# Altium project PCB_Project.PrjPcb
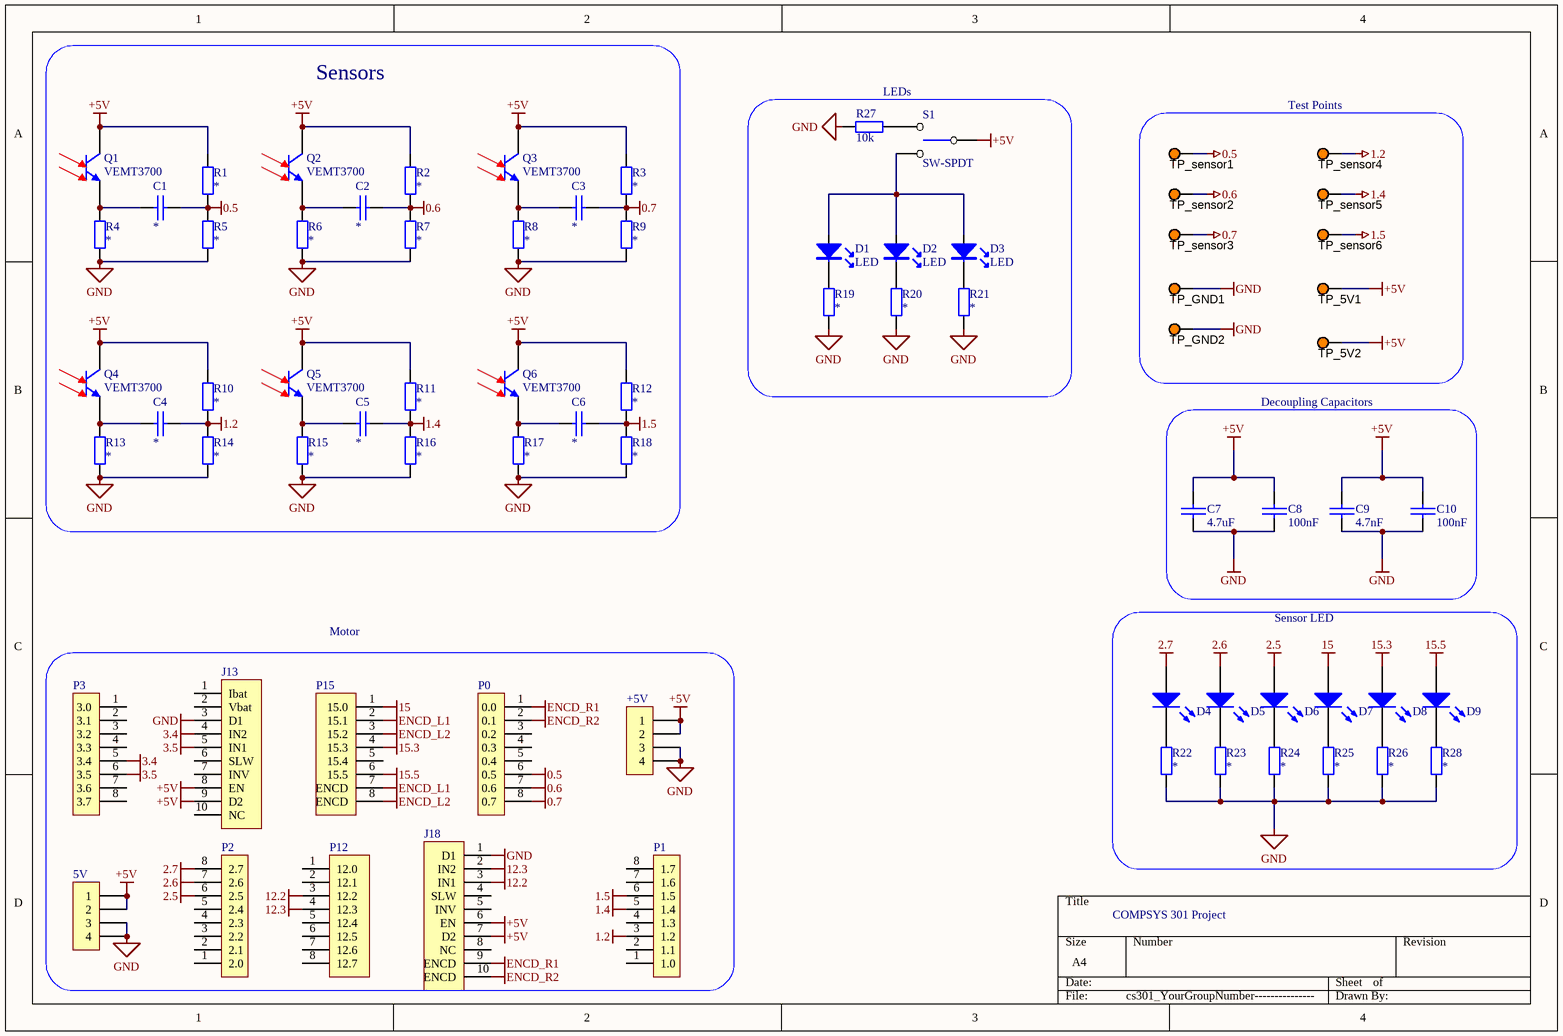
[diagram p0: cs301_YourGroupNumber---------------.SchDoc]
1 sheet, 74 parts. Net scope: global (net labels, ports and power ports of the same name join across sheets).
Board file: cs301_YourGroupNumber--4 holes.PcbDoc

## Sheet cs301_YourGroupNumber---------------.SchDoc
size A4; SheetNumber: 1; SheetTotal: 1

### Parts
5V  5V  [IDC4]  (value not drawn)
+5V  5V  [IDC4]  (value not drawn)
C1  *  [0805 CAP]
C2  *  [0805 CAP]
C3  *  [0805 CAP]
C4  *  [0805 CAP]
C5  *  [0805 CAP]
C6  *  [0805 CAP]
C7  4.7uF  [0805 CAP]
C8  100nF  [0805 CAP]
C9  4.7nF  [0805 CAP]
C10  100nF  [0805 CAP]
D1  LED  [LED0.1/5MM]
D2  LED  [LED0.1/5MM]
D3  LED  [LED0.1/5MM]
D4  LTST-C170KGKT  [0805 LED]  (value not drawn)
D5  LTST-C170KGKT  [0805 LED]  (value not drawn)
D6  LTST-C170KGKT  [0805 LED]  (value not drawn)
D7  LTST-C170KGKT  [0805 LED]  (value not drawn)
D8  LTST-C170KGKT  [0805 LED]  (value not drawn)
D9  LTST-C170KGKT  [0805 LED]  (value not drawn)
J13  CON10  [idc10]  (value not drawn)
J18  CON10  [IDC10]  (value not drawn)
P0  P0  [idc8]  (value not drawn)
P1  P1  [idc8]  (value not drawn)
P2  P2  [idc8]  (value not drawn)
P3  P3  [idc8]  (value not drawn)
P12  P12  [idc8]  (value not drawn)
P15  P15  [idc8]  (value not drawn)
Q1  VEMT3700  [VEMT3700]
Q2  VEMT3700  [VEMT3700]
Q3  VEMT3700  [VEMT3700]
Q4  VEMT3700  [VEMT3700]
Q5  VEMT3700  [VEMT3700]
Q6  VEMT3700  [VEMT3700]
R1  *  [0805 RES]
R2  *  [0805 RES]
R3  *  [0805 RES]
R4  *  [0805 RES]
R5  *  [0805 RES]
R6  *  [0805 RES]
R7  *  [0805 RES]
R8  *  [0805 RES]
R9  *  [0805 RES]
R10  *  [0805 RES]
R11  *  [0805 RES]
R12  *  [0805 RES]
R13  *  [0805 RES]
R14  *  [0805 RES]
R15  *  [0805 RES]
R16  *  [0805 RES]
R17  *  [0805 RES]
R18  *  [0805 RES]
R19  *  [0805 RES]
R20  *  [0805 RES]
R21  *  [0805 RES]
R22  *  [0805 RES]
R23  *  [0805 RES]
R24  *  [0805 RES]
R25  *  [0805 RES]
R26  *  [0805 RES]
R27  10k  [0805 RES]
R28  *  [0805 RES]
S1  SW-SPDT  [SW-SPDT]
TP_5V1  5003  [TP_TH]  (value not drawn)
TP_5V2  5003  [TP_TH]  (value not drawn)
TP_GND1  5003  [TP_TH]  (value not drawn)
TP_GND2  5003  [TP_TH]  (value not drawn)
TP_sensor1  5003  [TP_TH]  (value not drawn)
TP_sensor2  5003  [TP_TH]  (value not drawn)
TP_sensor3  5003  [TP_TH]  (value not drawn)
TP_sensor4  5003  [TP_TH]  (value not drawn)
TP_sensor5  5003  [TP_TH]  (value not drawn)
TP_sensor6  5003  [TP_TH]  (value not drawn)

### Blocks framed on the sheet
Sensors: C1-C6 Q1-Q6 R1-R18
LEDs: D1-D3 R19-R21 R27 S1
Test Points: TP_5V1 TP_5V2 TP_GND1 TP_GND2 TP_sensor1-TP_sensor6
Decoupling Capacitors: C7-C10
Sensor LED: D4-D9 R22-R26 R28
Motor: 5V +5V J13 J18 P0-P3 P12 P15

### Nets
0.5: C1.2 P0.6(0.5) R1.1 R5.2 TP_sensor1.1
0.6: C2.2 P0.7(0.6) R2.1 R7.2 TP_sensor2.1
0.7: C3.2 P0.8(0.7) R3.1 R9.2 TP_sensor3.1
1.2: C4.2 P1.3(1.2) R10.1 R14.2 TP_sensor4.1
1.4: C5.2 P1.5(1.4) R11.1 R16.2 TP_sensor5.1
1.5: C6.2 P1.6(1.5) R12.1 R18.2 TP_sensor6.1
2.5: D6.1(A) P2.6(2.5)
2.6: D5.1(A) P2.7(2.6)
2.7: D4.1(A) P2.8(2.7)
3.4: J13.4(IN2) P3.5(3.4)
3.5: J13.5(IN1) P3.6(3.5)
12.2: J18.3(IN1) P12.3(12.2)
12.3: J18.2(IN2) P12.4(12.3)
15: D7.1(A) P15.1(15.0)
15.3: D8.1(A) P15.4(15.3)
15.5: D9.1(A) P15.6(15.5)
+5V: 5V.1 5V.2 +5V.1 +5V.2 C7.1 C8.1 C9.1 C10.1 J13.8(EN) J13.9(D2) J18.6(EN) J18.7(D2) Q1.1(C) Q2.1(C) Q3.1(C) Q4.1(C) Q5.1(C) Q6.1(C) R1.2 R2.2 R3.2 R10.2 R11.2 R12.2 S1.2 TP_5V1.1 TP_5V2.1
ENCD_L1: P15.2(15.1) P15.7(ENCD)
ENCD_L2: P15.3(15.2) P15.8(ENCD)
ENCD_R1: J18.9(ENCD) P0.1(0.0)
ENCD_R2: J18.10(ENCD) P0.2(0.1)
GND: 5V.3 5V.4 +5V.3 +5V.4 C7.2 C8.2 C9.2 C10.2 J13.3(D1) J18.1(D1) R4.1 R5.1 R6.1 R7.1 R8.1 R9.1 R13.1 R14.1 R15.1 R16.1 R17.1 R18.1 R19.1 R20.1 R21.1 R22.1 R23.1 R24.1 R25.1 R26.1 R27.1 R28.1 TP_GND1.1 TP_GND2.1
NetC1_1: C1.1 Q1.2(E) R4.2
NetC2_1: C2.1 Q2.2(E) R6.2
NetC3_1: C3.1 Q3.2(E) R8.2
NetC4_1: C4.1 Q4.2(E) R13.2
NetC5_1: C5.1 Q5.2(E) R15.2
NetC6_1: C6.1 Q6.2(E) R17.2
NetD1_A: D1.A D2.A D3.A S1.1
NetD1_K: D1.K R19.2
NetD2_K: D2.K R20.2
NetD3_K: D3.K R21.2
NetD4_2: D4.2(K) R22.2
NetD5_2: D5.2(K) R23.2
NetD6_2: D6.2(K) R24.2
NetD7_2: D7.2(K) R25.2
NetD8_2: D8.2(K) R26.2
NetD9_2: D9.2(K) R28.2
NetR27_2: R27.2 S1.3

Not connected (* = marked no-connect by the designer): J13 1(Ibat) 2(Vbat) 6(SLW) 7(INV) 10(NC); J18 4(SLW) 5(INV) 8(NC); P0 3(0.2) 4(0.3) 5(0.4); P1 1(1.0) 2(1.1) 4(1.3) 7(1.6) 8(1.7); P2 1(2.0) 2(2.1) 3(2.2) 4(2.3) 5(2.4); P3 1(3.0) 2(3.1) 3(3.2) 4(3.3) 7(3.6) 8(3.7); P12 1(12.0) 2(12.1) 5(12.4) 6(12.5) 7(12.6) 8(12.7); P15 5(15.4)

### Notes on the sheet
- COMPSYS 301 Project

### Library data of the parts
5V +5V = CON4: Connector
C1-C10 = CerCap_SMT_0805: SMT ceramic capacitor 0805 size; Value: *
D4-D9 = LED_SMT_0805: SMT LED 0805 size; Manufacturer: Lite-On Inc.; Color: Green; Lens Color: Colorless; Lens Transparency: Clear; Millicandela Rating: 35mcd; Lens Style/Size: Rectangle with Flat Top, 1.40mm x 1.25mm; Voltage - Forward (Vf) (Typ): 2V; Current - Test: 20mA; Viewing Angle: 130°; Wavelength - Dominant: 571nm; Wavelength - Peak: 574nm; Supplier 1: Digi-Key; Manufacturer Part Number: LTST-C170KGKT; RoHS: RoHS Compliant; Category: Optoelectronics; Stock 1: 503069; Pricing 1: 1=0.62, 10=0.459, 25=0.338, 100=0.2415, 250=0.16416, 500=0.14486, 1000=0.11347 (NZD); Packaging: Cut Tape (CT); Part Status: Active; Mounting Type: Surface Mount; Features: -; Package / Case: 0805 (2012 Metric); Size / Dimension: 2.00mm L x 1.25mm W; Height (Max): 1.10mm; ComponentLink1URL: http://optoelectronics.liteon.com/upload/download/DS22-2000-073/LTST-C170KGKT.pdf; ComponentLink1Description: http://optoelectronics.liteon.com/upload/download/DS22-2000-073/LTST-C170KGKT.pdf; Supplier Part Number 1: 160-1414-1-ND
J13 J18 = CON10: Connector
P0-P3 = CON8: Connector
P12 P15 = CON8_1: Connector
Q1-Q6 = VEMT3700: Silicon NPN Phototransistor
R1-R28 = Res_SMT_0805: 0805 resistor; Published: 8-Jun-2000; LatestRevisionDate: 17-Jul-2002; LatestRevisionNote: Re-released for DXP Platform.; PackageReference: AXIAL-0.4; Publisher: Altium Limited; Value: *; ComponentLink1Description: https://nz.mouser.com/datasheet/2/315/AOA0000C304-1149620.pdf
S1 = SW-SPDT: Toggle Switch
TP_5V1 TP_5V2 TP_GND1 TP_GND2 TP_sensor1-TP_sensor6 = TestPoint: Test Point, Orange, 1-Pin THD, RoHS; Peak Reverse Current: 600 uA; Forward Current: 3 A; Max Surge Current: 80 A; Forward Voltage: 1.08 V; Max Operating Temperature: 150 degC; PackageReference: 5003; Pins: 2; ComponentLink2URL: http://keyelco.com/userAssets/file/M65p56.pdf; PackageDescription: 1-Pin Through Hole Device, Dia 2.54 mm; Weight: 0.01 lb; Diameter: 5.3 mm; Mount: Through Hole; Package Quantity: 500; Packaging: Bulk; Min Operating Temperature: -65 degC; ComponentLink1Description: Manufacturer URL; Height: 0.25 inch; ComponentLink1URL: http://www.keyelco.com/; ComponentLink2Description: Datasheet; Width: 0.25 inch; REACH SVHC: No SVHC; RoHSCompliant: true; Radiation Hardening: No; Length: 9.5 mm; DatasheetVersion: Jun-15